# EAGLE design ShieldOV7670FlatCable (EAGLE 9.4.2)
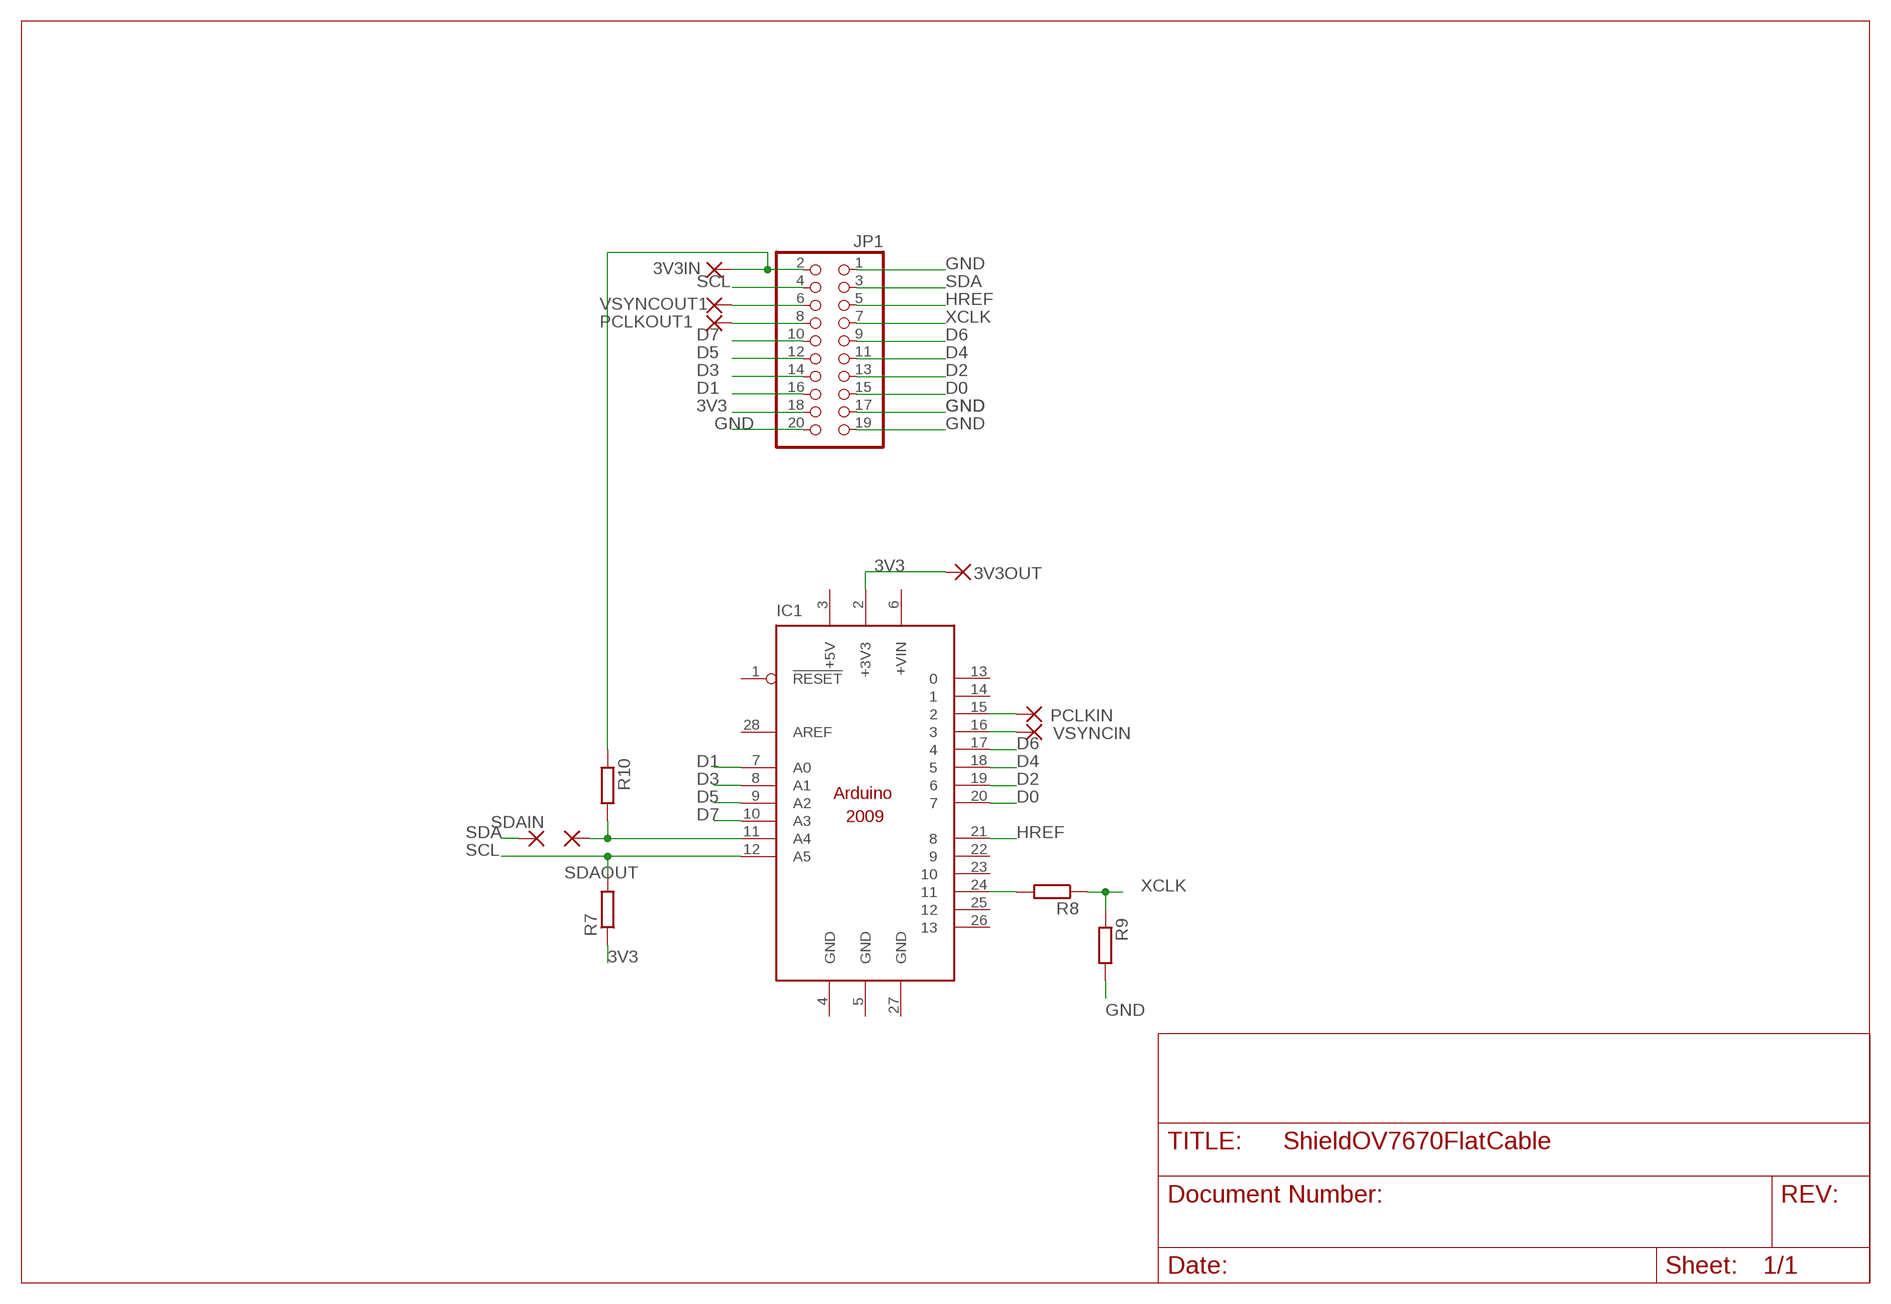
[diagram p0: schematic, sheet 1]

## Parts
3V3IN  1,6/0,9  [1,6/0,9]
3V3OUT  1,6/0,9  [1,6/0,9]
IC1  ARDUINO2009_12  [ARDUINO2009_2]
JP1  PINHD-2X10  [2X10]
PCLKIN  1,6/0,9  [1,6/0,9]
PCLKOUT1  1,6/0,9  [1,6/0,9]
R7  R-EU_0207/12  [0207/12]
R8  R-EU_0207/12  [0207/12]
R9  R-EU_0207/12  [0207/12]
R10  R-EU_0207/12  [0207/12]
SDAIN  1,6/0,9  [1,6/0,9]
SDAOUT  1,6/0,9  [1,6/0,9]
VSYNCIN  1,6/0,9  [1,6/0,9]
VSYNCOUT1  1,6/0,9  [1,6/0,9]

## Nets
3V3: 3V3OUT.1(P) IC1.2(+3V3) JP1.18 R7.1
D0: IC1.20 JP1.15
D1: IC1.7(A0) JP1.16
D2: IC1.19 JP1.13
D3: IC1.8(A1) JP1.14
D4: IC1.18 JP1.11
D5: IC1.9(A2) JP1.12
D6: IC1.17 JP1.9
D7: IC1.10(A3) JP1.10
GND: JP1.1 JP1.17 JP1.19 JP1.20 R9.2
HREF: IC1.21 JP1.5
N$1: IC1.15 PCLKIN.1(P)
N$2: IC1.16 VSYNCIN.1(P)
N$3: 3V3IN.1(P) JP1.2 R10.1
N$4: IC1.11(A4) R10.2 SDAOUT.1(P)
N$7: IC1.24 R8.2
N$8: JP1.6 VSYNCOUT1.1(P)
N$9: JP1.8 PCLKOUT1.1(P)
SCL: IC1.12(A5) JP1.4 R7.2
SDA: JP1.3 SDAIN.1(P)
XCLK: JP1.7 R8.1 R9.1
Unconnected: IC1.1(!RESET) IC1.6(+VIN) IC1.13 IC1.14 IC1.22 IC1.23 IC1.25 IC1.26 IC1.28(AREF)

## Power pins joined to a net without a drawn wire
+5V: IC1.3(+5V)
GND: IC1.4(GND) IC1.5(GND) IC1.27(GND)

## Library data of the parts
3V3IN 3V3OUT PCLKIN PCLKOUT1 SDAIN SDAOUT VSYNCIN VSYNCOUT1 = wirepad:1,6/0,9: THROUGH-HOLE PAD
IC1 = arduino:ARDUINO2009_1: The Arduino Duemilanove ("2009") is a microcontroller board based on the ATmega168 or ATmega328. - 14 digital input/output pins (of which 6 can be used as PWM outputs) - 6 analog inputs, a 16 MHz crystal oscillator - USB connection - power jack - ISP header - reset button It contains everything needed to support the microcontroller; simply connect it to a computer with a USB cable or power it with a AC-to-DC adapter or battery to get started http://arduino.cc/en/Main/ArduinoBoardDuemilanove
JP1 = pinhead:PINHD-2X10: PIN HEADER
R7-R10 = rcl:R-EU_: RESISTOR, European symbol; SPICEPREFIX: R

## Board
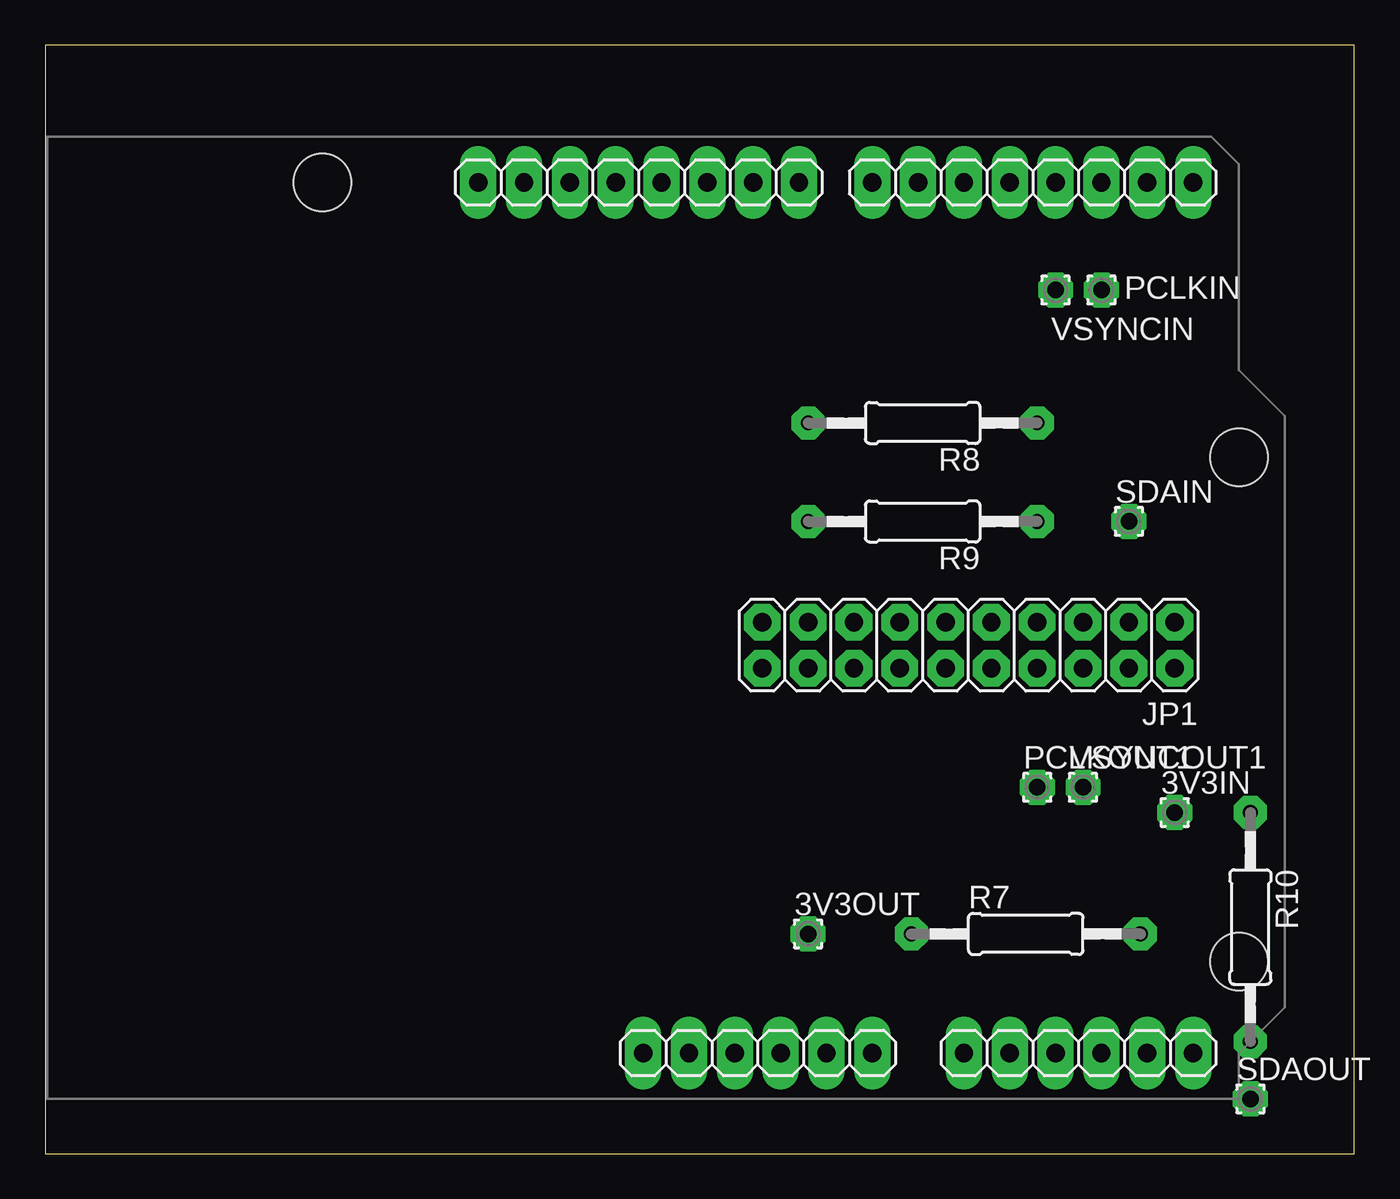
[diagram p1: board, top side]
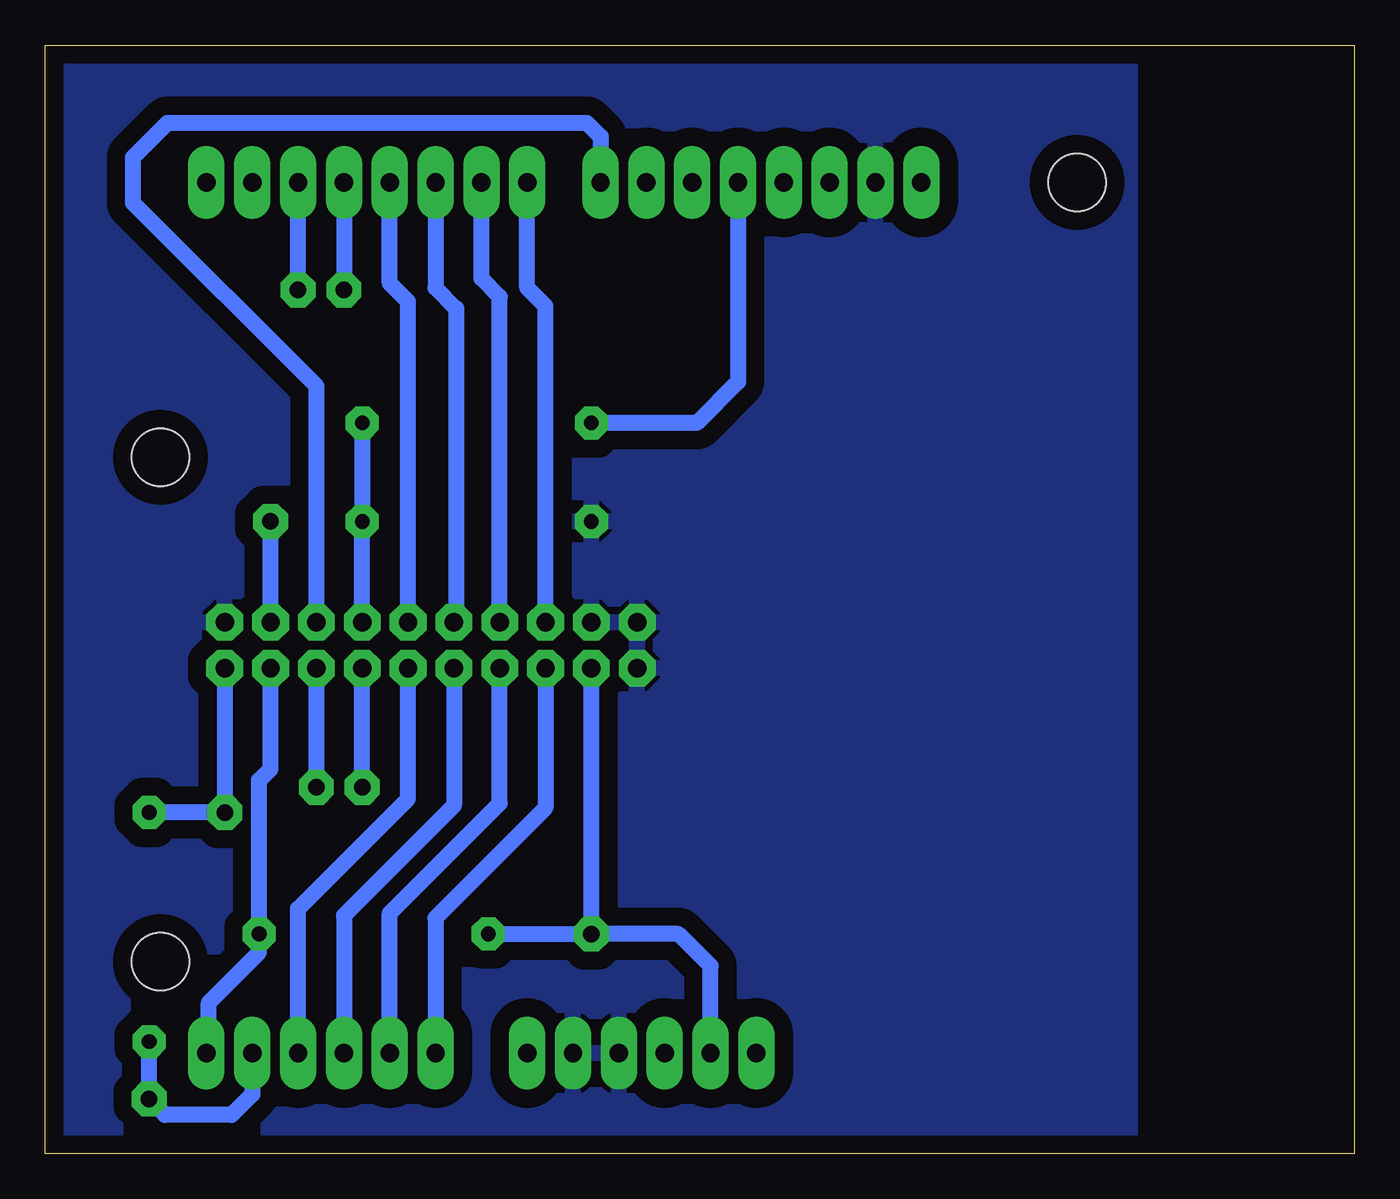
[diagram p2: board, bottom side, seen from below]

Size 72.57 x 61.46 mm. Coordinates in mm from the lower left corner, seen from the top.
Outline: 0,0 72.57,0 72.57,61.46 0,61.46 0,0
Copper layers (1*16): Top 0.035mm / dielectric 1.5mm / Bottom 0.035mm
Design rules "default *": minimum track width 35mil, minimum drill 0.35mm, track to track 20mil, track to pad 20mil, pad to pad 20mil, via to via 20mil, smd to smd 6mil, copper to edge 40mil, drill to drill 6mil, minimum pad ring 20mil, minimum via ring 8mil, stop-mask expansion 4mil, vias tented up to drill 0mil, thermal gap 10mil

### Footprints (pad centres in the part's own frame; a part is rotated, then mirrored left to right if it is on the bottom)
1,6/0,9 = drill 0.914 pad 1.6 octagon: 1 0,0
ARDUINO2009_2 = drill 1.016 long: 1 33.02,2.54; 2 35.56,2.54; 3 38.1,2.54; 4 40.64,2.54; 5 43.18,2.54; 6 45.72,2.54; 7 50.8,2.54; 8 53.34,2.54; 9 55.88,2.54; 10 58.42,2.54; 11 60.96,2.54; 12 63.5,2.54; 13 63.5,50.8; 14 60.96,50.8; 15 58.42,50.8; 16 55.88,50.8; 17 53.34,50.8; 18 50.8,50.8; 19 48.26,50.8; 20 45.72,50.8; 21 41.656,50.8; 22 39.116,50.8; 23 36.576,50.8; 24 34.036,50.8; 25 31.496,50.8; 26 28.956,50.8; 27 26.416,50.8; 28 23.876,50.8 | hole 3.2: 15.24,50.8; 66.04,35.56; 66.04,7.62
2X10 = drill 1.016 octagon: 1 -11.43,-1.27; 2 -11.43,1.27; 3 -8.89,-1.27; 4 -8.89,1.27; 5 -6.35,-1.27; 6 -6.35,1.27; 7 -3.81,-1.27; 8 -3.81,1.27; 9 -1.27,-1.27; 10 -1.27,1.27; 11 1.27,-1.27; 12 1.27,1.27; 13 3.81,-1.27; 14 3.81,1.27; 15 6.35,-1.27; 16 6.35,1.27; 17 8.89,-1.27; 18 8.89,1.27; 19 11.43,-1.27; 20 11.43,1.27
0207/12 = drill 0.813 octagon: 1 -6.35,0; 2 6.35,0

### Placement (x,y rotation side)
3V3IN  62.61,18.92 0 top
3V3OUT  42.29,12.19 0 top
IC1  0.13,3.05 0 top
JP1  51.18,28.19 180 top
PCLKIN  58.55,47.88 0 top
PCLKOUT1  54.99,20.32 0 top
R7  54.36,12.19 0 top
R8  48.64,40.51 180 top
R9  48.64,35.05 180 top
R10  66.8,12.57 270 top
SDAIN  60.07,35.05 0 top
SDAOUT  66.8,3.05 0 top
VSYNCIN  56.01,47.88 0 top
VSYNCOUT1  57.53,20.32 0 top

### Tracks (layer width: path | path; a pad name or v marks a point on that pad's centre or on a via)
3V3
  Bottom 0.889: R7.1 3V3OUT.1 | 3V3OUT.1 JP1.18 | IC1.2 35.69,10.41 37.47,12.19 3V3OUT.1
D0
  Bottom 0.889: JP1.15 44.83,46.99 45.85,48.01 IC1.20
D1
  Bottom 0.889: JP1.16 44.83,19.18 50.93,13.08 IC1.7
D2
  Bottom 0.889: JP1.13 47.37,47.5 48.39,48.51 IC1.19
D3
  Bottom 0.889: JP1.14 47.37,19.43 53.47,13.34 IC1.8
D4
  Bottom 0.889: IC1.18 50.93,48.01 49.78,46.86 49.78,29.59 JP1.11
D5
  Bottom 0.889: JP1.12 49.91,19.3 56.01,13.21 IC1.9
D6
  Bottom 0.889: JP1.9 52.45,47.24 53.47,48.26 IC1.17
D7
  Bottom 0.889: IC1.10 58.55,13.59 52.45,19.69 JP1.10
GND
  pour Bottom (isolate 1.016): 12.45,61.21 12.45,0.13 72.39,0.13 72.39,61.09 12.57,61.09
HREF
  Bottom 0.889: JP1.5 57.53,42.55 67.69,52.7 67.69,55.25 65.79,57.15 42.55,57.15 41.78,56.39 IC1.21
N$1
  Bottom 0.889: PCLKIN.1 IC1.15
N$2
  Bottom 0.889: IC1.16 VSYNCIN.1
N$3
  Bottom 0.889: JP1.2 3V3IN.1 R10.1
N$4
  Bottom 0.889: R10.2 SDAOUT.1 65.91,2.16 62.23,2.16 61.09,3.3 IC1.11
N$7
  Bottom 0.889: IC1.24 34.16,42.8 36.45,40.51 R8.2
N$8
  Bottom 0.889: VSYNCOUT1.1 JP1.6
N$9
  Bottom 0.889: PCLKOUT1.1 JP1.8
SCL
  Bottom 0.889: IC1.12 63.5,5.71 63.5,8.38 60.71,11.18 R7.2 60.71,20.7 60.07,21.34 JP1.4
SDA
  Bottom 0.889: JP1.3 SDAIN.1
XCLK
  Bottom 0.889: JP1.7 R9.1 R8.1